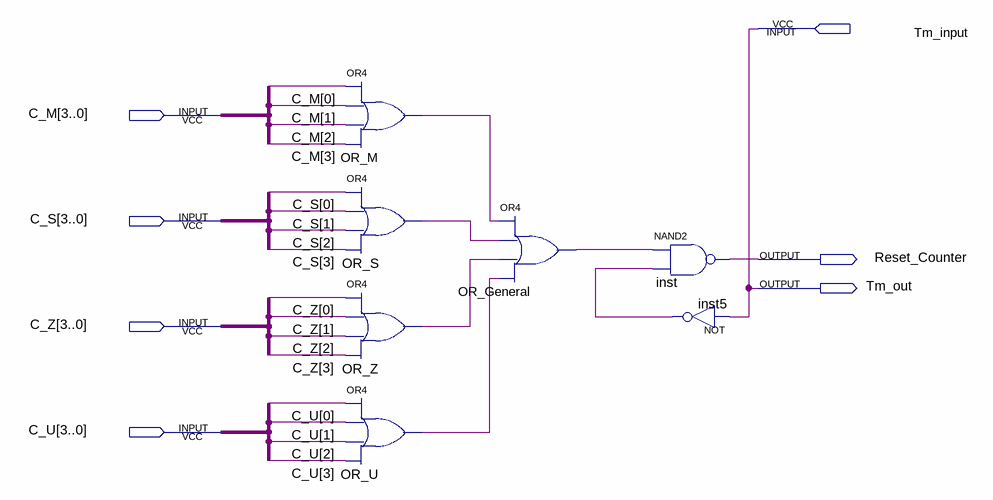
[diagram p0: schematic sheet]
// Quartus schematic Bloc_Comanda.bdf as structural Verilog: 7 symbols, 7 pins
module Bloc_Comanda (
  input  Tm_input,
  input  [3:0] C_M,
  input  [3:0] C_S,
  input  [3:0] C_Z,
  input  [3:0] C_U,
  output Reset_Counter,
  output Tm_out
);

  wire inst5_out, OR_General_out, OR_M_out, OR_S_out, OR_U_out, OR_Z_out;

  or OR_M (OR_M_out, C_M[0], C_M[1], C_M[2], C_M[3]);
  or OR_S (OR_S_out, C_S[0], C_S[1], C_S[2], C_S[3]);
  or OR_Z (OR_Z_out, C_Z[0], C_Z[1], C_Z[2], C_Z[3]);
  or OR_U (OR_U_out, C_U[0], C_U[1], C_U[2], C_U[3]);
  or OR_General (OR_General_out, OR_M_out, OR_S_out, OR_Z_out, OR_U_out);
  nand inst (Reset_Counter, OR_General_out, inst5_out);
  not inst5 (inst5_out, Tm_input);

  assign Tm_out = Tm_input;
endmodule
